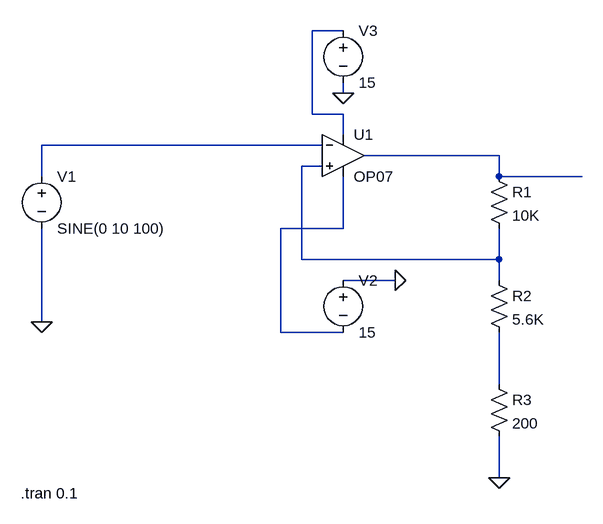
[diagram p0: schematic Draft5.asc]
Draft5.asc, the LTspice schematic file:
Version 4
SHEET 1 1428 680
WIRE 480 -96 432 -96
WIRE 480 0 480 -16
WIRE 432 32 432 -96
WIRE 480 32 432 32
WIRE 480 64 480 32
WIRE 448 80 16 80
WIRE 720 96 512 96
WIRE 448 112 416 112
WIRE 16 128 16 80
WIRE 720 128 720 96
WIRE 848 128 720 128
WIRE 480 208 480 128
WIRE 480 208 384 208
WIRE 416 256 416 112
WIRE 720 256 720 208
WIRE 720 256 416 256
WIRE 560 288 480 288
WIRE 720 288 720 256
WIRE 16 352 16 208
WIRE 384 368 384 208
WIRE 480 368 384 368
WIRE 720 448 720 368
WIRE 720 592 720 528
FLAG 16 352 0
FLAG 720 592 0
FLAG 480 0 0
FLAG 560 288 0
SYMBOL voltage 16 112 R0
WINDOW 123 0 0 Left 0
WINDOW 39 0 0 Left 0
SYMATTR InstName V1
SYMATTR Value SINE(0 10 100)
SYMBOL OpAmps\\OP07 480 32 R0
SYMATTR InstName U1
SYMBOL res 704 112 R0
SYMATTR InstName R1
SYMATTR Value 10K
SYMBOL res 704 272 R0
SYMATTR InstName R2
SYMATTR Value 5.6K
SYMBOL res 704 432 R0
SYMATTR InstName R3
SYMATTR Value 200
SYMBOL voltage 480 272 R0
WINDOW 123 0 0 Left 0
WINDOW 39 0 0 Left 0
SYMATTR InstName V2
SYMATTR Value 15
SYMBOL voltage 480 -112 R0
WINDOW 123 0 0 Left 0
WINDOW 39 0 0 Left 0
SYMATTR InstName V3
SYMATTR Value 15
TEXT -16 616 Left 2 !.tran 0.1

The netlist it stands for:
* Draft5.asc
V1 N002 0 SINE(0 10 100)
XU1 N004 N002 N001 N005 N003 LT1001  ; OP07, pins In+ In- V+ V- OUT
R1 N003 N004 10K
R2 N004 N006 5.6K
R3 N006 0 200
V2 0 N005 15
V3 N001 0 15
.tran 0.1
.lib LTC.lib
.backanno
.end